# Altium schematic sheet 05-RESET.SchDoc
size A4; DocumentNumber: 14; SheetNumber: 14; SheetTotal: 34
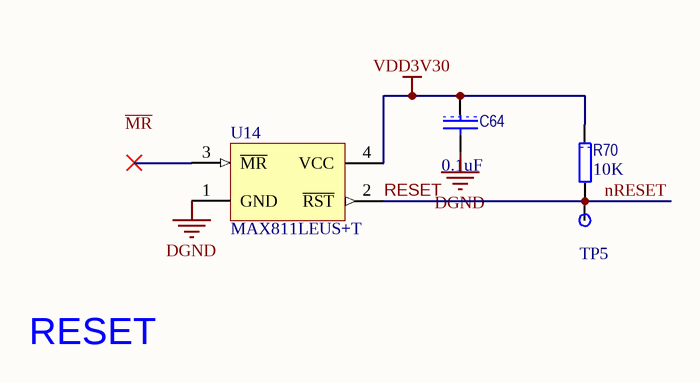
[diagram p0: 05-RESET.SchDoc]

## Parts
C64  value 0.1uF  [1608[0603]C]  (hidden comment: C1608X7R1H104K)
R70  value 10K  [1608[0603]R]  (hidden comment: CRCW060310K0FKEA)
TP5  TP  [TP]  (value not drawn)
U14  MAX811LEUS+T  [SOT143_N]

## Nets
DGND: C64.2 U14.1(GND)
VDD3V30: C64.1 R70.1 U14.4(VCC)
nRESET: R70.2 TP5.1(TestPoint) U14.2(~{RST})  [also labelled RESET]

Not connected (* = marked no-connect by the designer): U14 3(~{MR})*

## Notes on the sheet
- RESET
- Labels drawn without touching a wire or pin: ~{MR}

## Library data of the parts
C64 = CAP: 多层陶瓷电容器MLCC - SMD/SMT 0603 0.1uF 50volts X7R 10%; Manufacturer: TDK; 产品: General Type MLCCs; 产品种类: Low & Medium Capacitance SMD Ceramic Chip Capacitors; 外壳代码 - in: 0603; 外壳代码 - mm: 1608; 封装 / 箱体: 0603 (1608 metric); 封装: Reel; 尺寸: 0.8 mm W x 1.6 mm L x 0.8 mm H; 工作温度范围: - 55 C to + 125 C; 标准包装数量: 4000; 电压额定值: 50 V; 电容-nF: 100 nF; 电容-pF: 100000 pF; 系列: C; Category: 多层陶瓷电容器MLCC - SMD/SMT; ComponentLink1Description: http://www.tdk.com/pdf/general_B11.pdf; ComponentLink1URL: http://www.tdk.com/pdf/general_B11.pdf; Description 1: 多层陶瓷电容器MLCC - SMD/SMT 0603 0.1uF 50volts X7R 10%; Manufacturer Part Number: C1608X7R1H104K; Minimum Order Quantity: 1; Pricing 1: 1=0.160, 50=0.070, 100=0.036, 500=0.019, 1000=0.013, 4000=0.010, 8000=0.009, 12000=0.008, 20000=0.007 (USD); Reeling: True; RoHS - 贸泽: Y; RoHS: RoHS Compliant; Stock 1: 224604; Supplier 1: Mouser; Supplier Part Number 1: 810-C1608X7R1H104K; 制造商: TDK; 容差: 10 %; 温度系数/代码: X7R; 电容: 0.1 uF; 端接类型: SMD/SMT
R70 = RES: 厚膜电阻器 - SMD 1/10watt 10Kohms 1%; Manufacturer: Vishay / Dale; 尺寸: 0.85 mm W x 1.55 mm L x 0.45 mm H; 工作温度范围: - 55 C to + 155 C; 封装 / 箱体: 0603 (1608 metric); 封装: Reel; 功率额定值: 100 mW; 产品: Thick Film Resistors SMD; 系列: CRCW; 温度系数: 100 PPM / K; 端接类型: SMD/SMT; 电压额定值: 75 V; 制造商: Vishay; 产品种类: 0603 Thick Film Chip Resistors; 标准包装数量: 5000; 外壳代码 - in: 0603; 外壳代码 - mm: 1608; Supplier 1: Mouser; Supplier Part Number 1: 71-CRCW0603-10K-E3; Manufacturer Part Number: CRCW060310K0FKEA; RoHS: RoHS Compliant By Exemption; Category: 厚膜电阻器 - SMD; Stock 1: 0; Pricing 1: 1=0.080, 10=0.013, 100=0.010, 1000=0.008, 5000=0.005, 25000=0.004, 50000=0.003 (USD); 电阻: 10 kOhms; 容差: 1 %; RoHS - 贸泽: E; Minimum Order Quantity: 1; Reeling: True; ComponentLink1URL: http://www.mouser.com/ds/2/427/dcrcwe3-109170.pdf; ComponentLink1Description: http://www.mouser.com/ds/2/427/dcrcwe3-109170.pdf; Description 1: 厚膜电阻器 - SMD 1/10watt 10Kohms 1%
TP5 = Test Point
U14 = MAX811-EUS-T: 监控电路 4-Pin uPower Voltage Monitor; Manufacturer: Maxim Integrated; 输出类型: Active Low, Push-Pull; 封装 / 箱体: SOT-143; 封装: Cut Tape; 系列: MAX811; 人工复位: Not Resettable; 监测电压数: 1; 过电压阈值: 4.72 V; 上电复位延迟（典型值）: 560 ms; 电源电流（典型值）: 6 uA; 欠电压阈值: 4.54 V; 监视器: No Watchdog; 电池备用开关: No Backup; 芯片启用信号: No; 最大工作温度: + 85 C; 最大功率耗散: 320 mW; 最小工作温度: - 40 C; 监测电压: 3 V, 3.3 V, 5 V; 电源电压-最小: 1.2 V; Supplier 1: Mouser; Supplier Part Number 1: 700-MAX811LEUST; Manufacturer Part Number: MAX811LEUS+T; RoHS: RoHS Compliant; Description 1: 监控电路 4-Pin uPower Voltage Monitor; Category: 监控电路; Stock 1: 3290; Pricing 1: 1=2.24, 25=1.69, 50=1.59, 100=1.48, 250=1.46, 500=1.42 (USD); 制造商: Maxim Integrated; 功率失效检测: No; RoHS - 贸泽: Y; Minimum Order Quantity: 1; Reeling: False; ComponentLink1URL: http://www.mouser.com/ds/2/256/MAX811-MAX812-190465.pdf; ComponentLink1Description: http://www.mouser.com/ds/2/256/MAX811-MAX812-190465.pdf